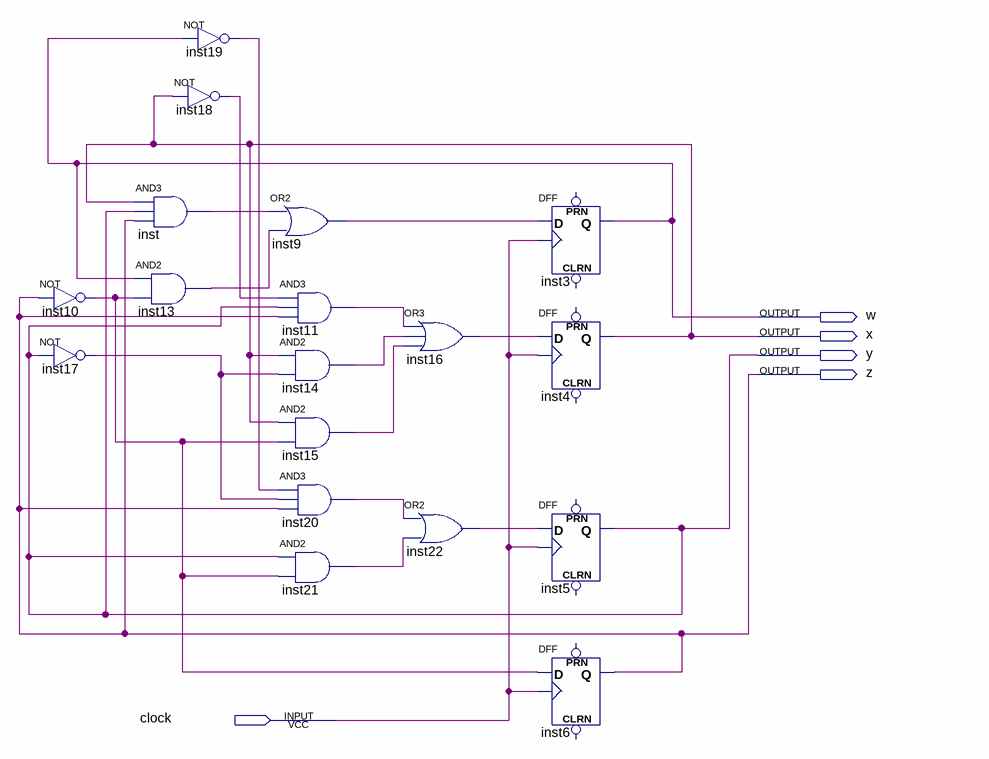
[diagram p0: schematic sheet]
// Quartus schematic count_09.bdf as structural Verilog: 18 symbols, 5 pins
module count_09 (
  input  clock,
  output w,
  output x,
  output y,
  output z
);

  wire inst9_out, inst10_out, inst11_out, inst13_out, inst14_out, inst15_out, inst16_out, inst17_out,
       inst18_out, inst19_out, inst20_out, inst21_out, inst22_out, inst_out;

  not inst10 (inst10_out, z);
  not inst17 (inst17_out, y);
  not inst19 (inst19_out, w);
  not inst18 (inst18_out, x);
  and inst (inst_out, x, y, z);
  and inst13 (inst13_out, w, inst10_out);
  or inst9 (inst9_out, inst_out, inst13_out);
  and inst11 (inst11_out, inst18_out, y, z);
  and inst14 (inst14_out, x, inst17_out);
  and inst15 (inst15_out, x, inst10_out);
  and inst20 (inst20_out, inst19_out, inst17_out, z);
  and inst21 (inst21_out, y, inst10_out);
  or inst16 (inst16_out, inst11_out, inst14_out, inst15_out);
  or inst22 (inst22_out, inst20_out, inst21_out);
  DFF inst3 (.CLK(clock), .D(inst9_out), .Q(w));  // open: CLRN, PRN
  DFF inst4 (.CLK(clock), .D(inst16_out), .Q(x));  // open: CLRN, PRN
  DFF inst5 (.CLK(clock), .D(inst22_out), .Q(y));  // open: CLRN, PRN
  DFF inst6 (.CLK(clock), .D(inst10_out), .Q(z));  // open: CLRN, PRN
endmodule
